# EAGLE design RAUPS_SingleLayer_Heater (EAGLE 7.2.0)
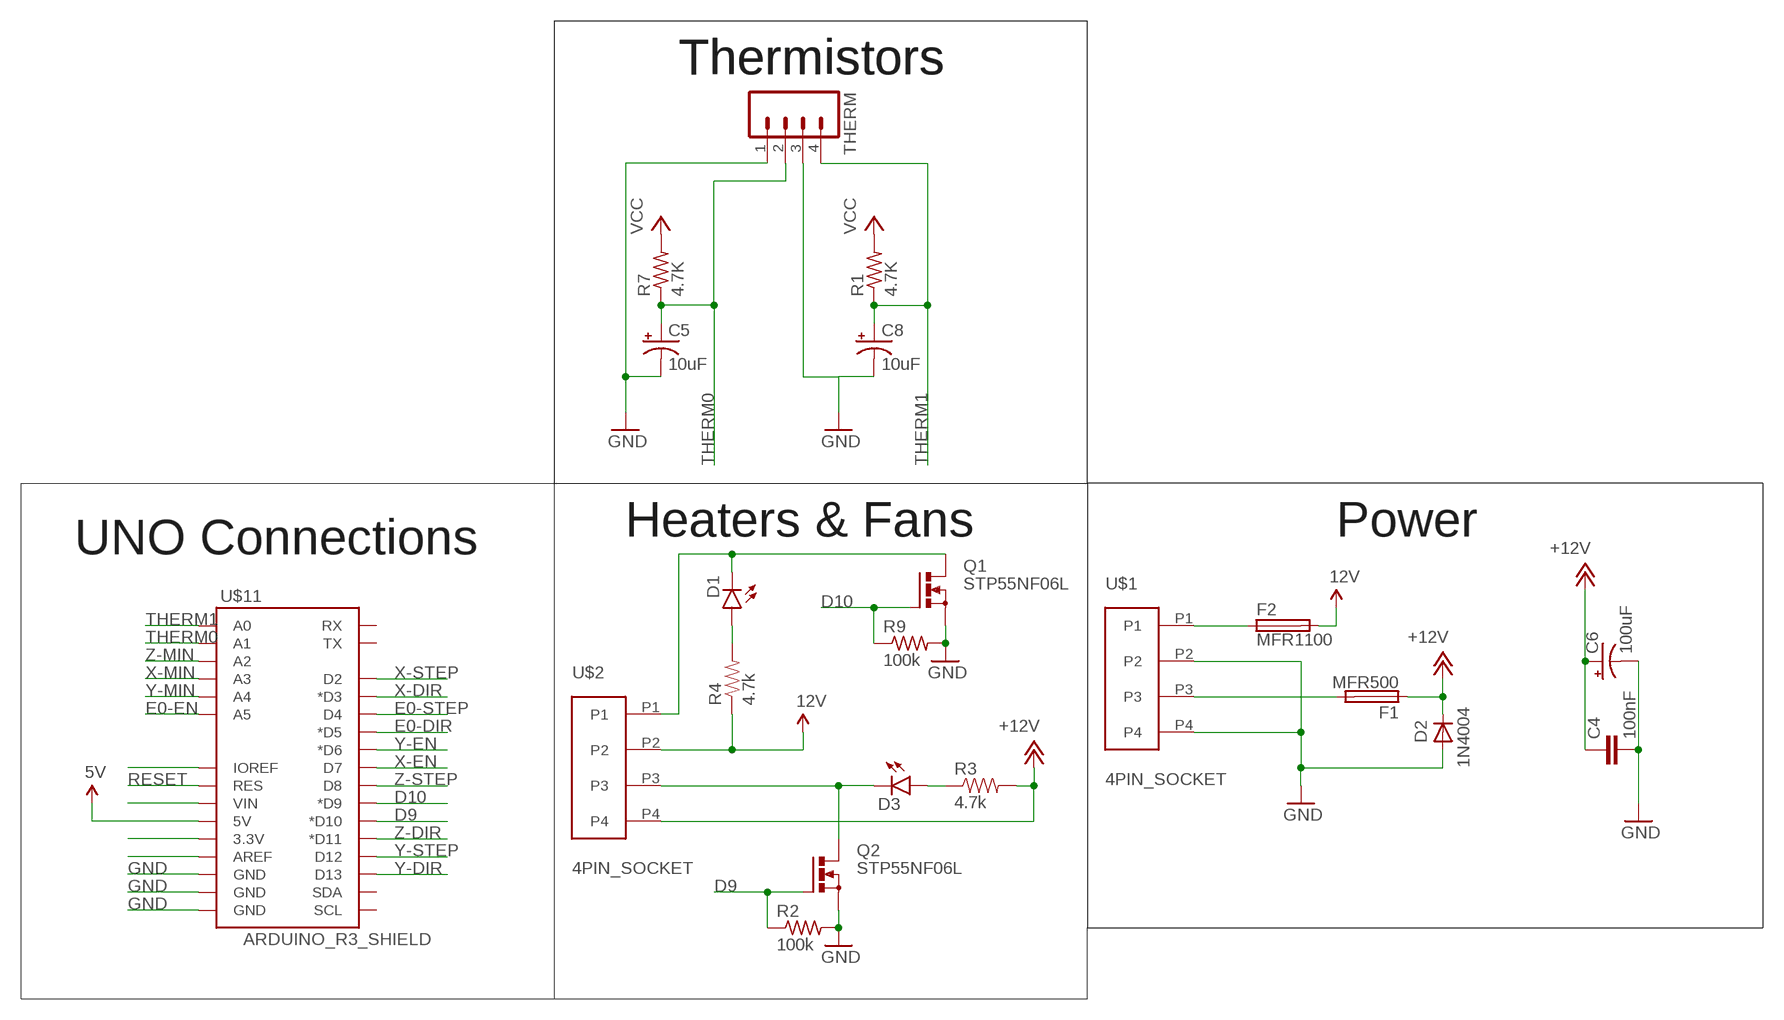
[diagram p0: schematic, sheet 1]

## Parts
C4  100nF  C2,5-3  [C2.5-3]
C5  10uF  CPOL-USE2.5-5  [E2,5-5]
C6  100uF  CPOL-USE3.5-8  [E3,5-8]
C8  10uF  CPOL-USE2.5-5  [E2,5-5]
D1  LED-3MM-NO_SILK  [LED3MM-NS]
D2  1N4004  [DO41-10]
D3  LED-3MM-NO_SILK  [LED3MM-NS]
F1  MFR500  PTCFUSE  [MFR500]
F2  MFR1100  PTCFUSEMFR1100  [MFR1100]
Q1  STP55NF06L  IRF512  [TO220BV]
Q2  STP55NF06L  IRF512  [TO220BV]
R1  4.7K  R-US_0207/7  [0207/7]
R2  100k  R-US_0207/7  [0207/7]
R3  4.7k  1KOHM-1/4W-5%(PTH)  [AXIAL-0.3]
R4  4.7k  1KOHM-1/4W-5%(PTH)  [AXIAL-0.3]
R7  4.7K  R-US_0207/7  [0207/7]
R9  100k  R-US_0207/7  [0207/7]
THERM  M04LONGPADS  [1X04_LONGPADS]
U$1  4PIN_SOCKET  [CONN-4PIN]
U$2  4PIN_SOCKET  [CONN-4PIN]
U$11  ARDUINO_R3_SHIELD  [UNO_R3_SHIELD]

## Nets
5V: U$11.5V
12V: F2.2 R4.P$1 U$2.P2
+12V: C4.1 C6.+ D2.C F1.1 R3.P$2 U$2.P4
D9: Q2.G R2.1 U$11.D10(*D10)
D10: Q1.G R9.1 U$11.D9(*D9)
E0-DIR: U$11.D5(*D5)
E0-EN: U$11.A5
E0-STEP: U$11.D4
GND: C4.2 C5.- C6.- C8.- D2.A Q1.S Q2.S R2.2 R9.2 THERM.1 THERM.3 U$1.P2 U$1.P4 U$11.GND@0(GND) U$11.GND@1(GND) U$11.GND@2(GND)
N$1: D3.K(C) Q2.D U$2.P3
N$2: F2.1 U$1.P1
N$7: D1.K(C) Q1.D U$2.P1
N$12: U$11.IOREF
N$16: U$11.VIN
N$24: U$11.3.3V
N$25: U$11.AREF
N$32: F1.2 U$1.P3
N$34: D1.A R4.P$2
N$35: D3.A R3.P$1
RESET: U$11.RES
THERM0: C5.+ R7.1 THERM.2 U$11.A1
THERM1: C8.+ R1.1 THERM.4 U$11.A0
VCC: R1.2 R7.2
X-DIR: U$11.D3(*D3)
X-EN: U$11.D7
X-MIN: U$11.A3
X-STEP: U$11.D2
Y-DIR: U$11.D13
Y-EN: U$11.D6(*D6)
Y-MIN: U$11.A4
Y-STEP: U$11.D12
Z-DIR: U$11.D11(*D11)
Z-MIN: U$11.A2
Z-STEP: U$11.D8
Unconnected: U$11.RX U$11.SCL U$11.SDA U$11.TX

## Notes on the sheet
- Thermistors | Thermistors
- Heaters & Fans | Power
- UNO Connections

## Library data of the parts
C4 = capacitor-wima:C: CAPACITOR naming: grid - package width
C5 C6 C8 = adafruit:CPOL-US: POLARIZED CAPACITOR, American symbol
D1 D3 = SparkFun-LED:LED: LEDs Standard schematic elements and footprints for 5mm, 3mm, 1206, and 0603 sized LEDs. 5mm - Spark Fun Electronics SKU : COM-00529 (and others)
D2 = diode:1N4004: DIODE general purpose rectifier, 1 A
F1 F2 = RepRapjr:PTCFUSE: LITTLEFUSE Picofuse/slow Littlefuse
Q1 Q2 = transistor-power:IRF512: N-CHANNEL MOS FET
R1 R2 R7 R9 = adafruit:R-US_: RESISTOR, American symbol
R3 R4 = SparkFun-Resistors:1KOHM-1/4W-5%(PTH): RES-08380; PROD_ID: RES-08380; VALE: 1k
THERM = SparkFun-Connectors:M04: Header 4 Standard 4-pin 0.1" header. Use with straight break away headers (SKU : PRT-00116), right angle break away headers (PRT-00553), swiss pins (PRT-00743), machine pins (PRT-00117), and female headers (PRT-00115). Molex polarized connector foot print use with SKU : PRT-08231 with associated crimp pins and housings. 1MM SMD Version SKU: PRT-10208
U$1 U$2 = ControllerCard:4PIN_SOCKET
U$11 = SparkFun-Boards:ARDUINO_R3_SHIELD: Shield form compatible with the Arduino Uno R3.

## Net classes
0 default: width 0.406 mm

## Board
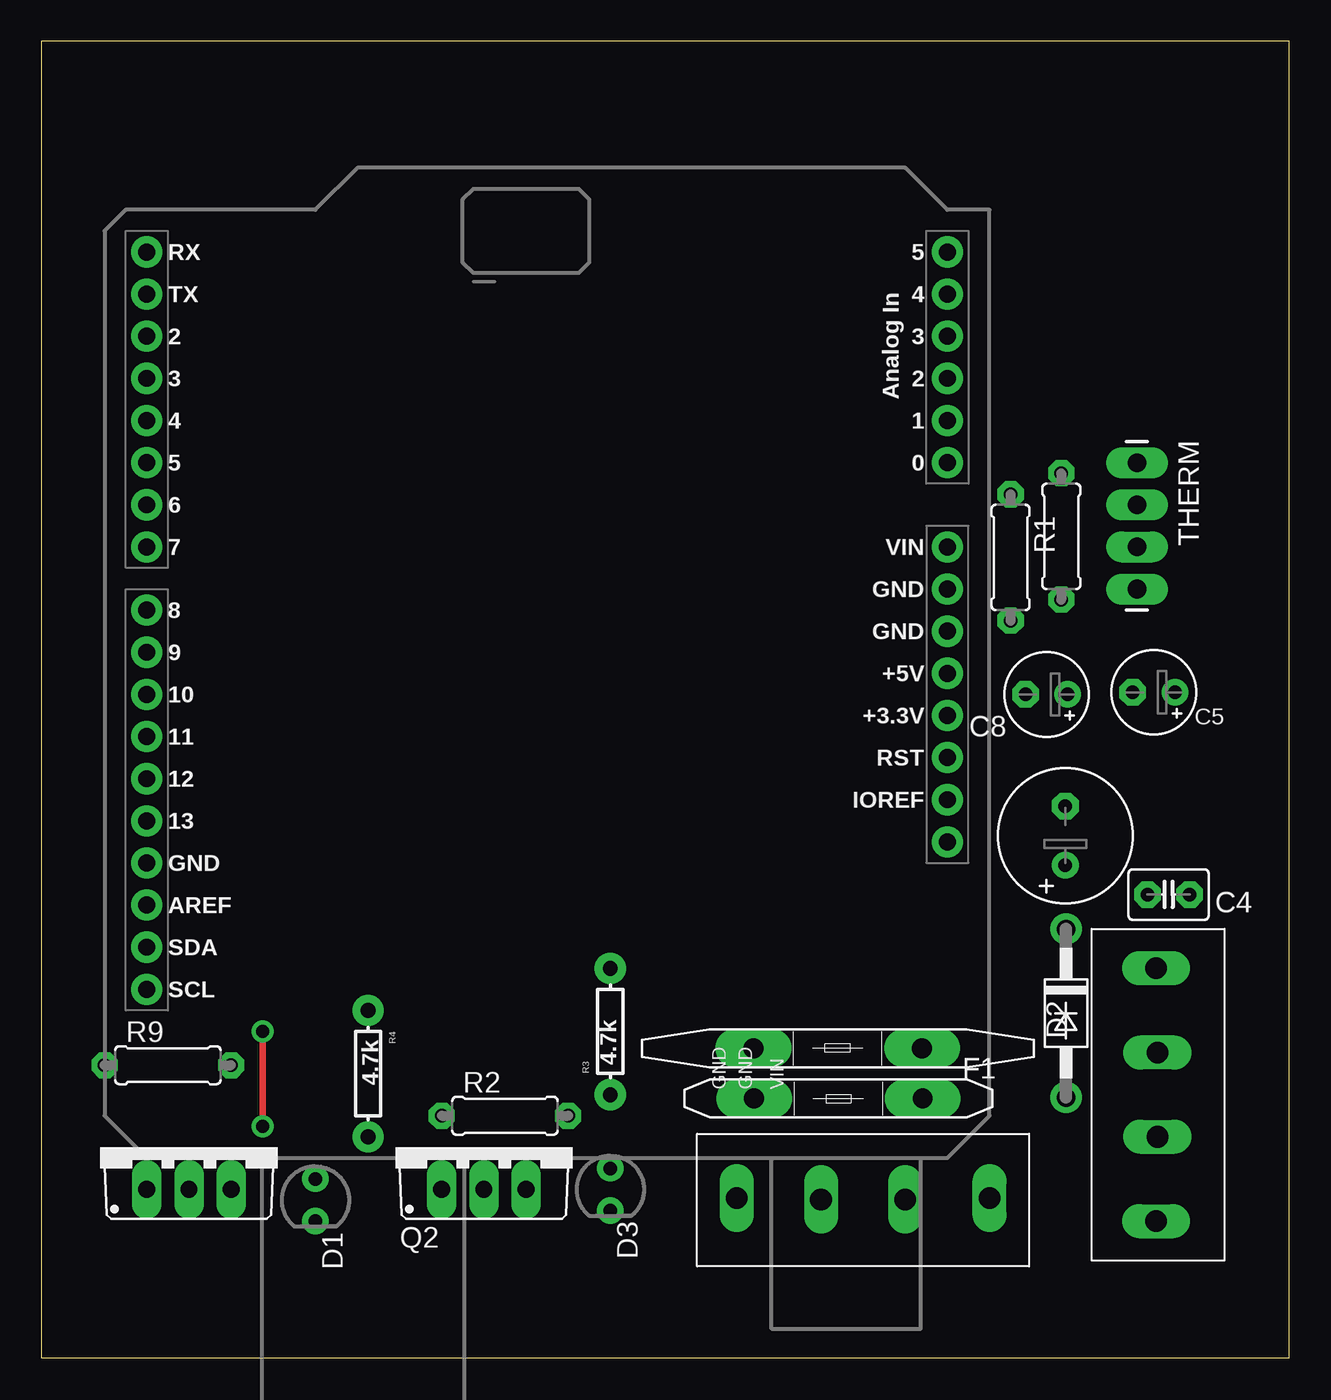
[diagram p1: board, top side]
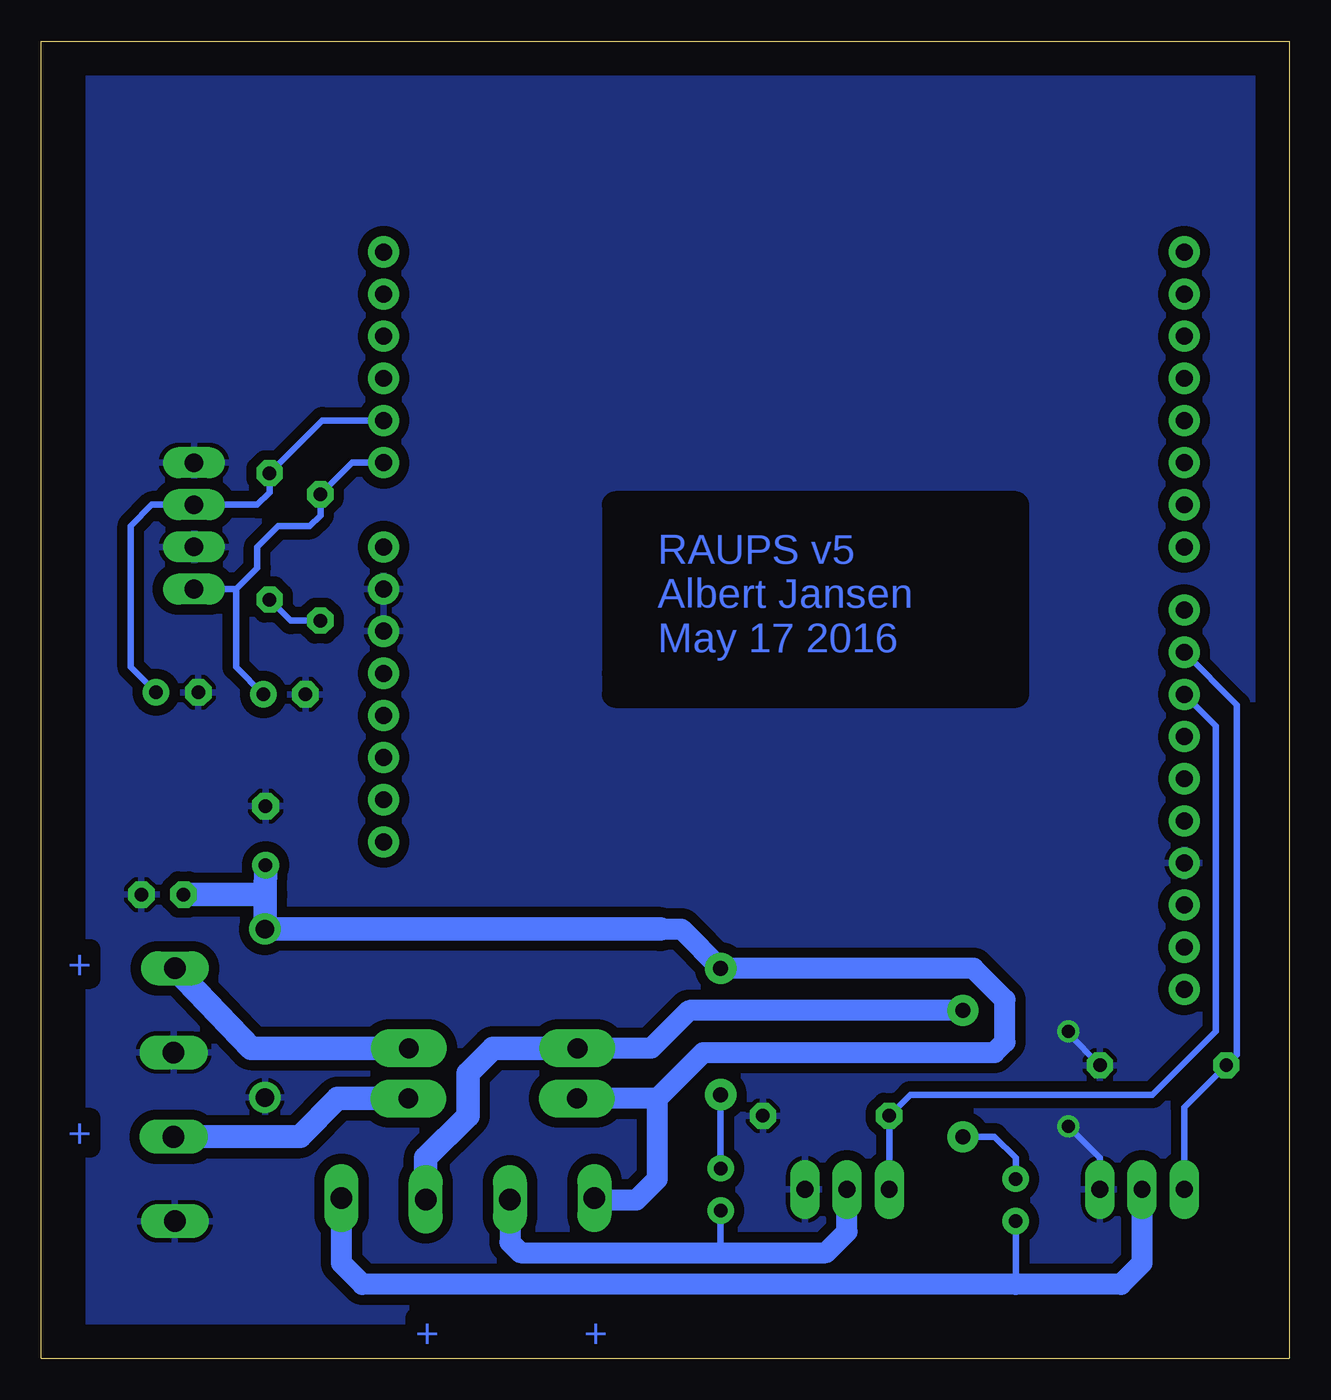
[diagram p2: board, bottom side, seen from below]

Size 75.23 x 79.37 mm. Coordinates in mm from the lower left corner, seen from the top.
Outline: 75.23,0 75.23,79.37 0,79.37 0,0 75.23,0
Copper layers (1*16): Top 0.035mm / dielectric 1.5mm / Bottom 0.035mm
Design rules "Humber Safe DRU *": minimum track width 10mil, minimum drill 20mil, track to track 20mil, track to pad 20mil, pad to pad 8mil, via to via 8mil, smd to smd 8mil, copper to edge 80mil, drill to drill 8mil, minimum pad ring 15mil, minimum via ring 10mil, stop-mask expansion 4mil, vias tented up to drill 25mil, thermal gap 10mil
bRestrict: area 16.5,40 to 40.6,51.4

### Footprints (pad centres in the part's own frame; a part is rotated, then mirrored left to right if it is on the bottom)
C2.5-3 = drill 0.813 pad 1.6 octagon: 1 -1.27,0; 2 1.27,0
E2,5-5 = drill 0.813 pad 1.6: + -1.27,0 | drill 0.813 pad 1.6 octagon: - 1.27,0
E3,5-8 = drill 0.813 pad 1.6: + -1.778,0 | drill 0.813 pad 1.6 octagon: - 1.778,0
LED3MM-NS = drill 0.813: A -1.27,0; K 1.27,0
DO41-10 = drill 1.118: A 5.08,0; C -5.08,0
MFR500 = drill 1.2 pad 2.3 long: 1 -5.08,0; 2 5.08,0
MFR1100 = drill 1.2 pad 2.3 long: 1 -5.08,0; 2 5.08,0
TO220BV = drill 1.016 long: D 0,-2.54; G -2.54,-2.54; S 2.54,-2.54
0207/7 = drill 0.813 octagon: 1 -3.81,0; 2 3.81,0
AXIAL-0.3 = drill 0.9 pad 1.88: P$1 -3.81,0; P$2 3.81,0
1X04_LONGPADS = drill 1.118 pad 1.88 long: 1 0,0; 2 2.54,0; 3 5.08,0; 4 7.62,0
CONN-4PIN = drill 1.3 long: P1 -7.62,-0.12; P2 -2.54,-0.04; P3 2.54,-0.04; P4 7.62,-0.12
UNO_R3_SHIELD = drill 1.016 pad 1.88: 3.3V 50.8,26.67; 5V 50.8,29.21; A0 50.8,41.91; A1 50.8,44.45; A2 50.8,46.99; A3 50.8,49.53; A4 50.8,52.07; A5 50.8,54.61; AREF 2.54,15.24; D2 2.54,49.53; D3 2.54,46.99; D4 2.54,44.45; D5 2.54,41.91; D6 2.54,39.37; D7 2.54,36.83; D8 2.54,33.02; D9 2.54,30.48; D10 2.54,27.94; D11 2.54,25.4; D12 2.54,22.86; D13 2.54,20.32; GND@0 50.8,31.75; GND@1 50.8,34.29; GND@2 2.54,17.78; IOREF 50.8,21.59; NC 50.8,19.05; RES 50.8,24.13; RX 2.54,54.61; SCL 2.54,10.16; SDA 2.54,12.7; TX 2.54,52.07; VIN 50.8,36.83

### Placement (x,y rotation side)
C4  67.94,27.94 0 top
C5  67.06,40.13 180 top
C6  61.72,31.5 90 top
C8  60.59,40.01 180 top
D1  16.51,9.52 270 top
D2  61.77,20.78 270 top
D3  34.29,10.16 270 top
F1  48.04,15.65 0 top
F2  48.01,18.67 180 top
Q1  8.89,12.7 0 top
Q2  26.67,12.7 0 top
R1  58.42,48.26 270 top
R2  27.94,14.61 0 top
R3  34.29,19.68 90 top
R4  19.68,17.14 270 top
R7  61.48,49.53 270 top
R9  7.62,17.65 0 top
THERM  66.04,53.98 270 top
U$1  67.31,15.88 270 top
U$2  49.53,9.52 180 top
U$11  3.81,12.07 0 top

### Tracks (layer width: path | path; a pad name or v marks a point on that pad's centre or on a via)
12V
  Bottom 1.27: F2.2 38.48,18.67 36.2,20.95 R4.P$1
  Bottom 1.422: F2.2 48.01,18.67 49.53,17.14 49.53,14.61 52.07,12.07 U$2.P2
+12V
  Bottom 1.27: 38.1,15.65 F1.1 | U$2.P4 41.79,9.52 39.37,9.52 38.1,10.8 38.1,15.65 | 37.93,25.86 36.66,25.86 R3.P$2 19.05,23.5 17.14,21.59 17.14,19.05 17.78,18.41 35.33,18.41 38.1,15.65
  Bottom 1.422: 61.74,27.94 D2.C 37.93,25.86 | 61.74,27.94 C6.+ | C4.1 61.74,27.94
D9
  Bottom 0.406: Q2.G R2.1 22.86,15.88 8.26,15.88 4.45,19.68 4.45,38.1 U$11.D10
D10
  Bottom 0.406: Q1.G 6.35,15.11 R9.1 3.17,18.29 3.17,39.37 U$11.D9
GND  (via drill 0.8)
  Top 0.406: v13.34,13.97 v13.34,19.68
  Bottom 0.406: Q1.S 11.43,12.07 v13.34,13.97 | v13.34,19.68 13.34,19.56 R9.2
  pour Bottom (isolate 0.61): 1.27,78.11 72.39,78.11 72.39,0.64 1.27,0.64
N$1
  Bottom 0.406: D3.K 34.29,6.35
  Bottom 1.27: U$2.P3 46.99,6.99 46.35,6.35 34.29,6.35 27.94,6.35 26.67,7.62 Q2.D
N$2
  Bottom 1.422: U$1.P1 62.6,18.67 F2.1
N$7
  Bottom 0.406: D1.K 16.51,4.45
  Bottom 1.27: Q1.D 8.89,5.72 10.16,4.45 16.51,4.45 55.88,4.45 57.15,5.72 U$2.P1
N$32
  Bottom 1.422: U$1.P3 59.65,13.38 57.38,15.65 F1.2
N$34
  Bottom 0.406: D1.A 16.51,12.07 17.78,13.34 R4.P$2
N$35
  Bottom 0.406: R3.P$1 D3.A
THERM0
  Bottom 0.406: U$11.A1 58.31,56.52 R7.1 61.48,52.18 62.23,51.44 THERM.2 68.58,51.44 69.85,50.17 69.85,41.66 C5.+
THERM1
  Bottom 0.406: U$11.A0 56.52,53.98 R1.1 58.42,50.8 59.05,50.17 60.96,50.17 62.23,48.9 62.23,47.62 63.5,46.36 | THERM.4 63.5,46.36 | C8.+ 63.5,41.65 63.5,46.36
VCC
  Bottom 0.406: R1.2 60.21,44.45 R7.2

### Text on the board
Bottom: RAUPS v5 / Albert Jansen / May 17 2016 | + | + | + | +
tNames: GND | GND | VIN